# EasyEDA schematic A2D_ascii.SchDoc_2021-05-28.json

## Sheets
1 A2D
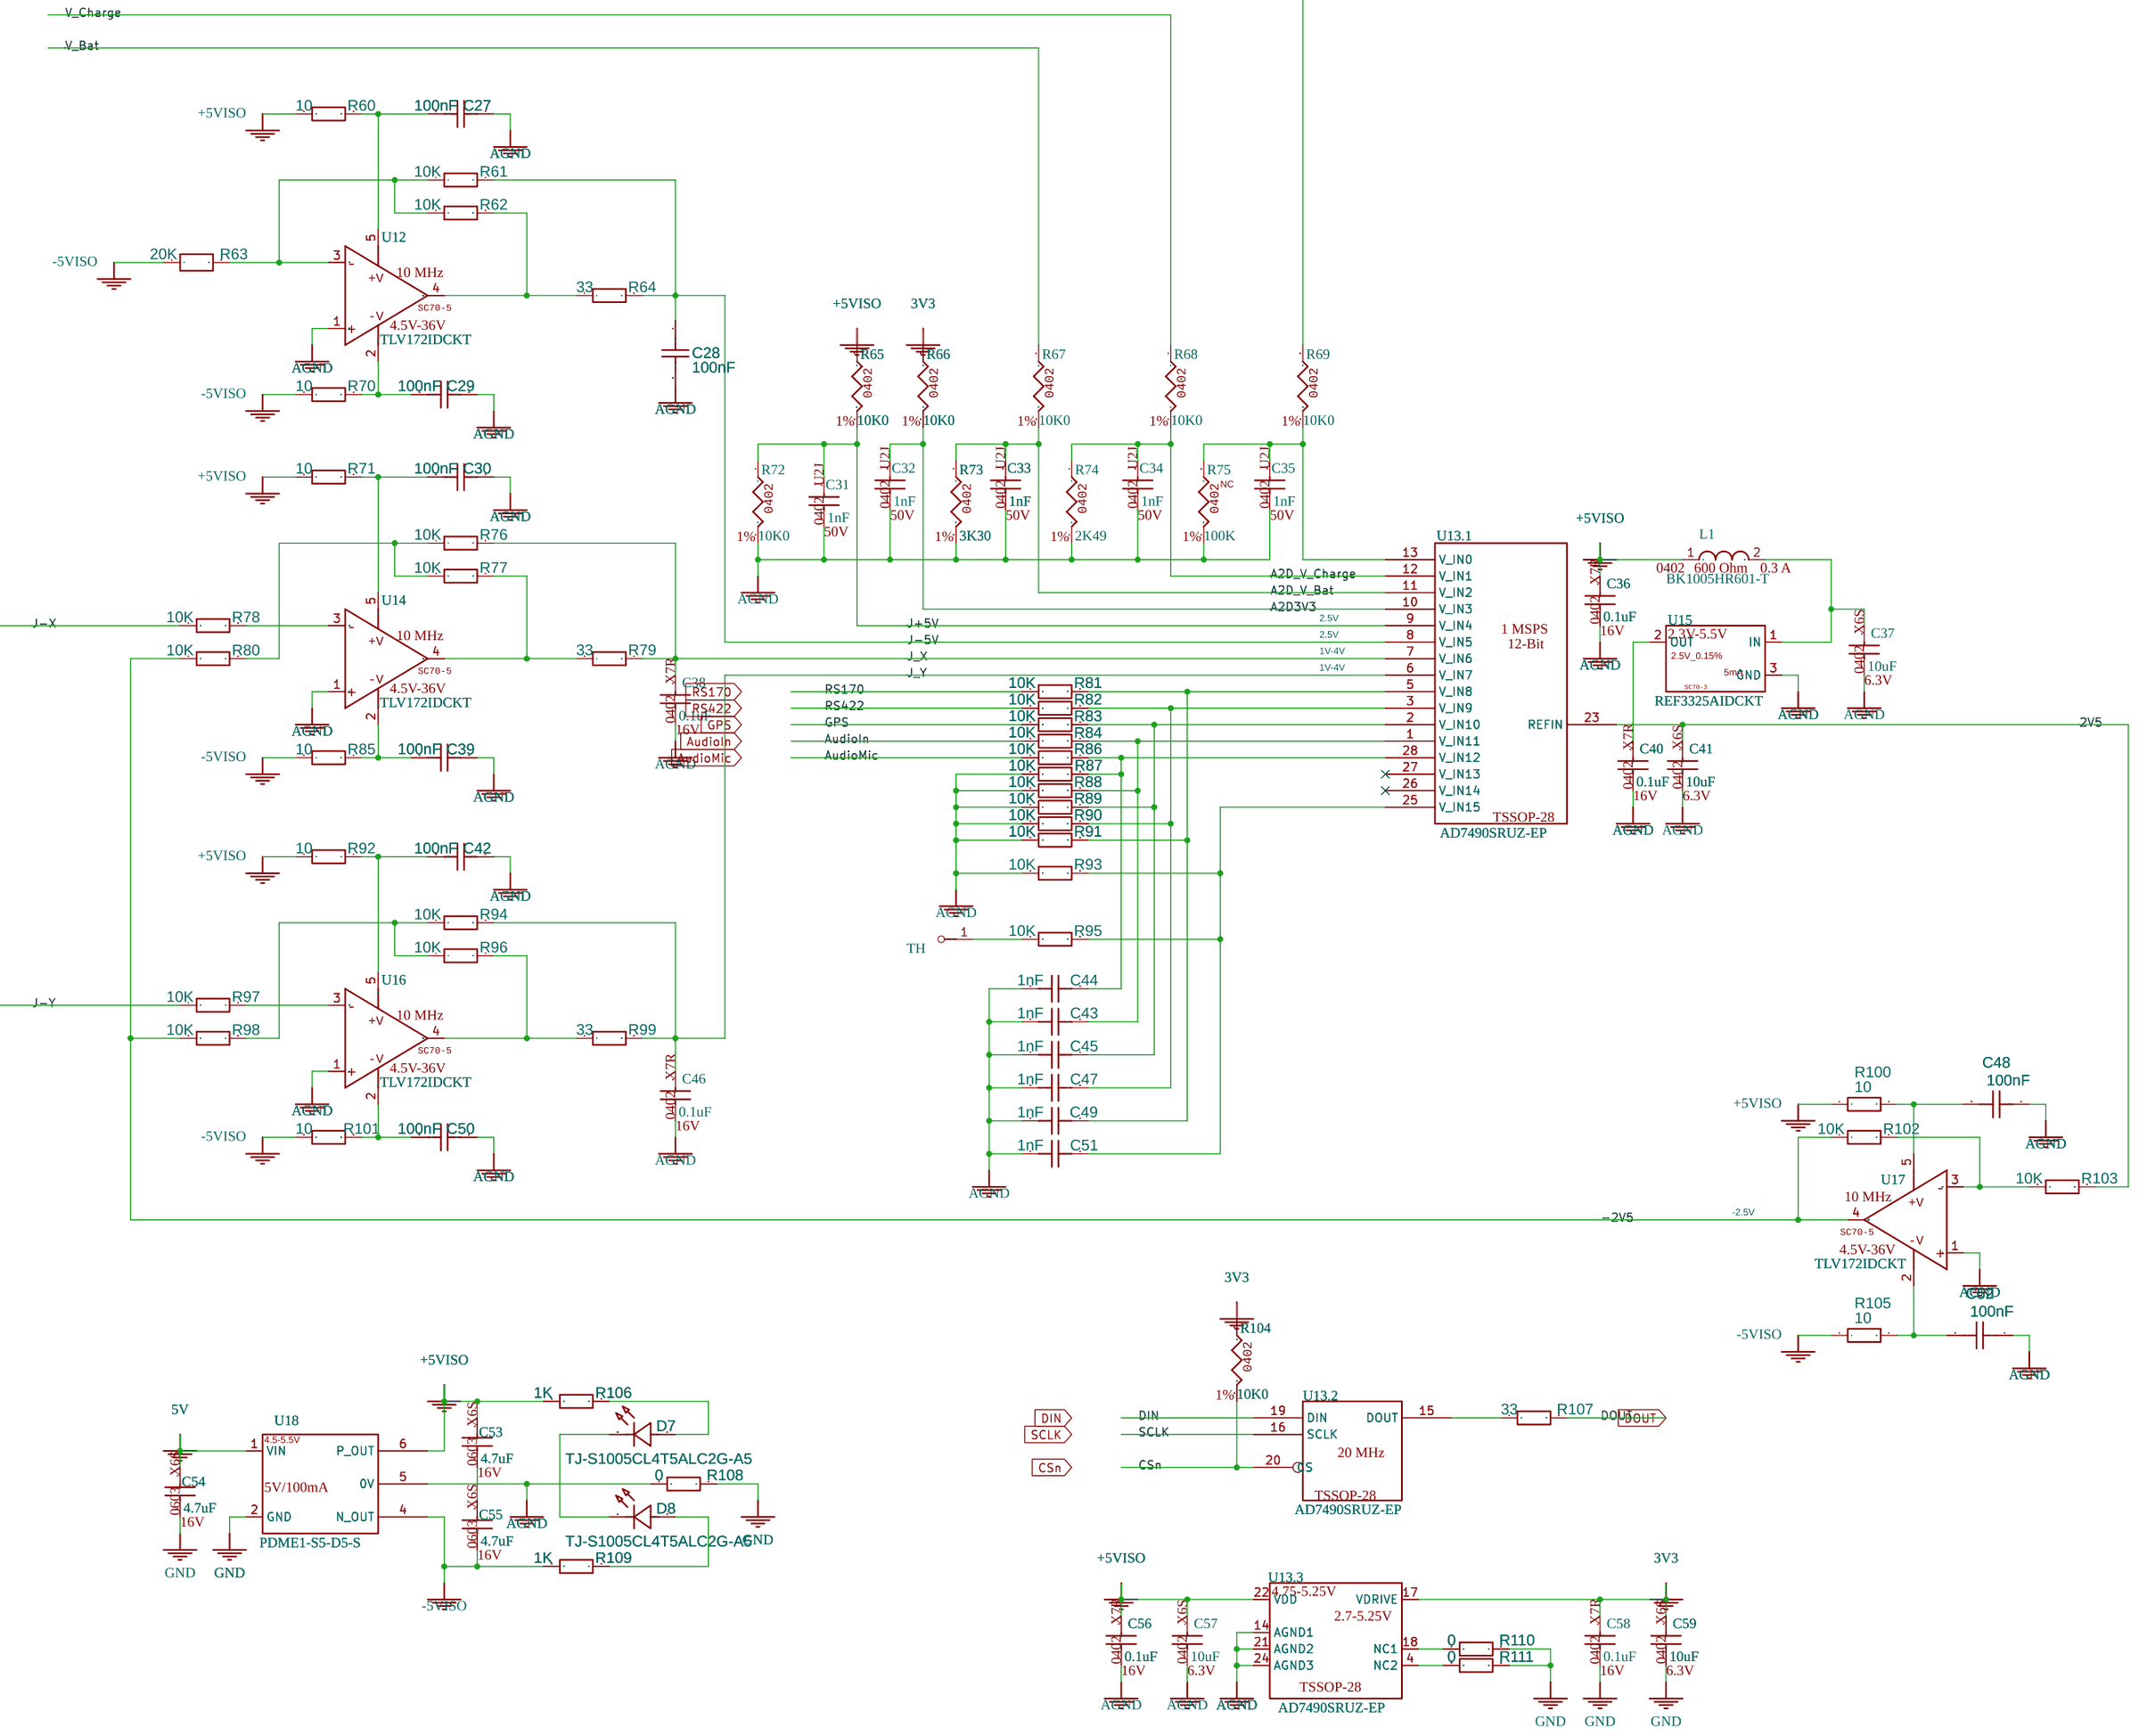
[diagram p0: A2D]
2 Main
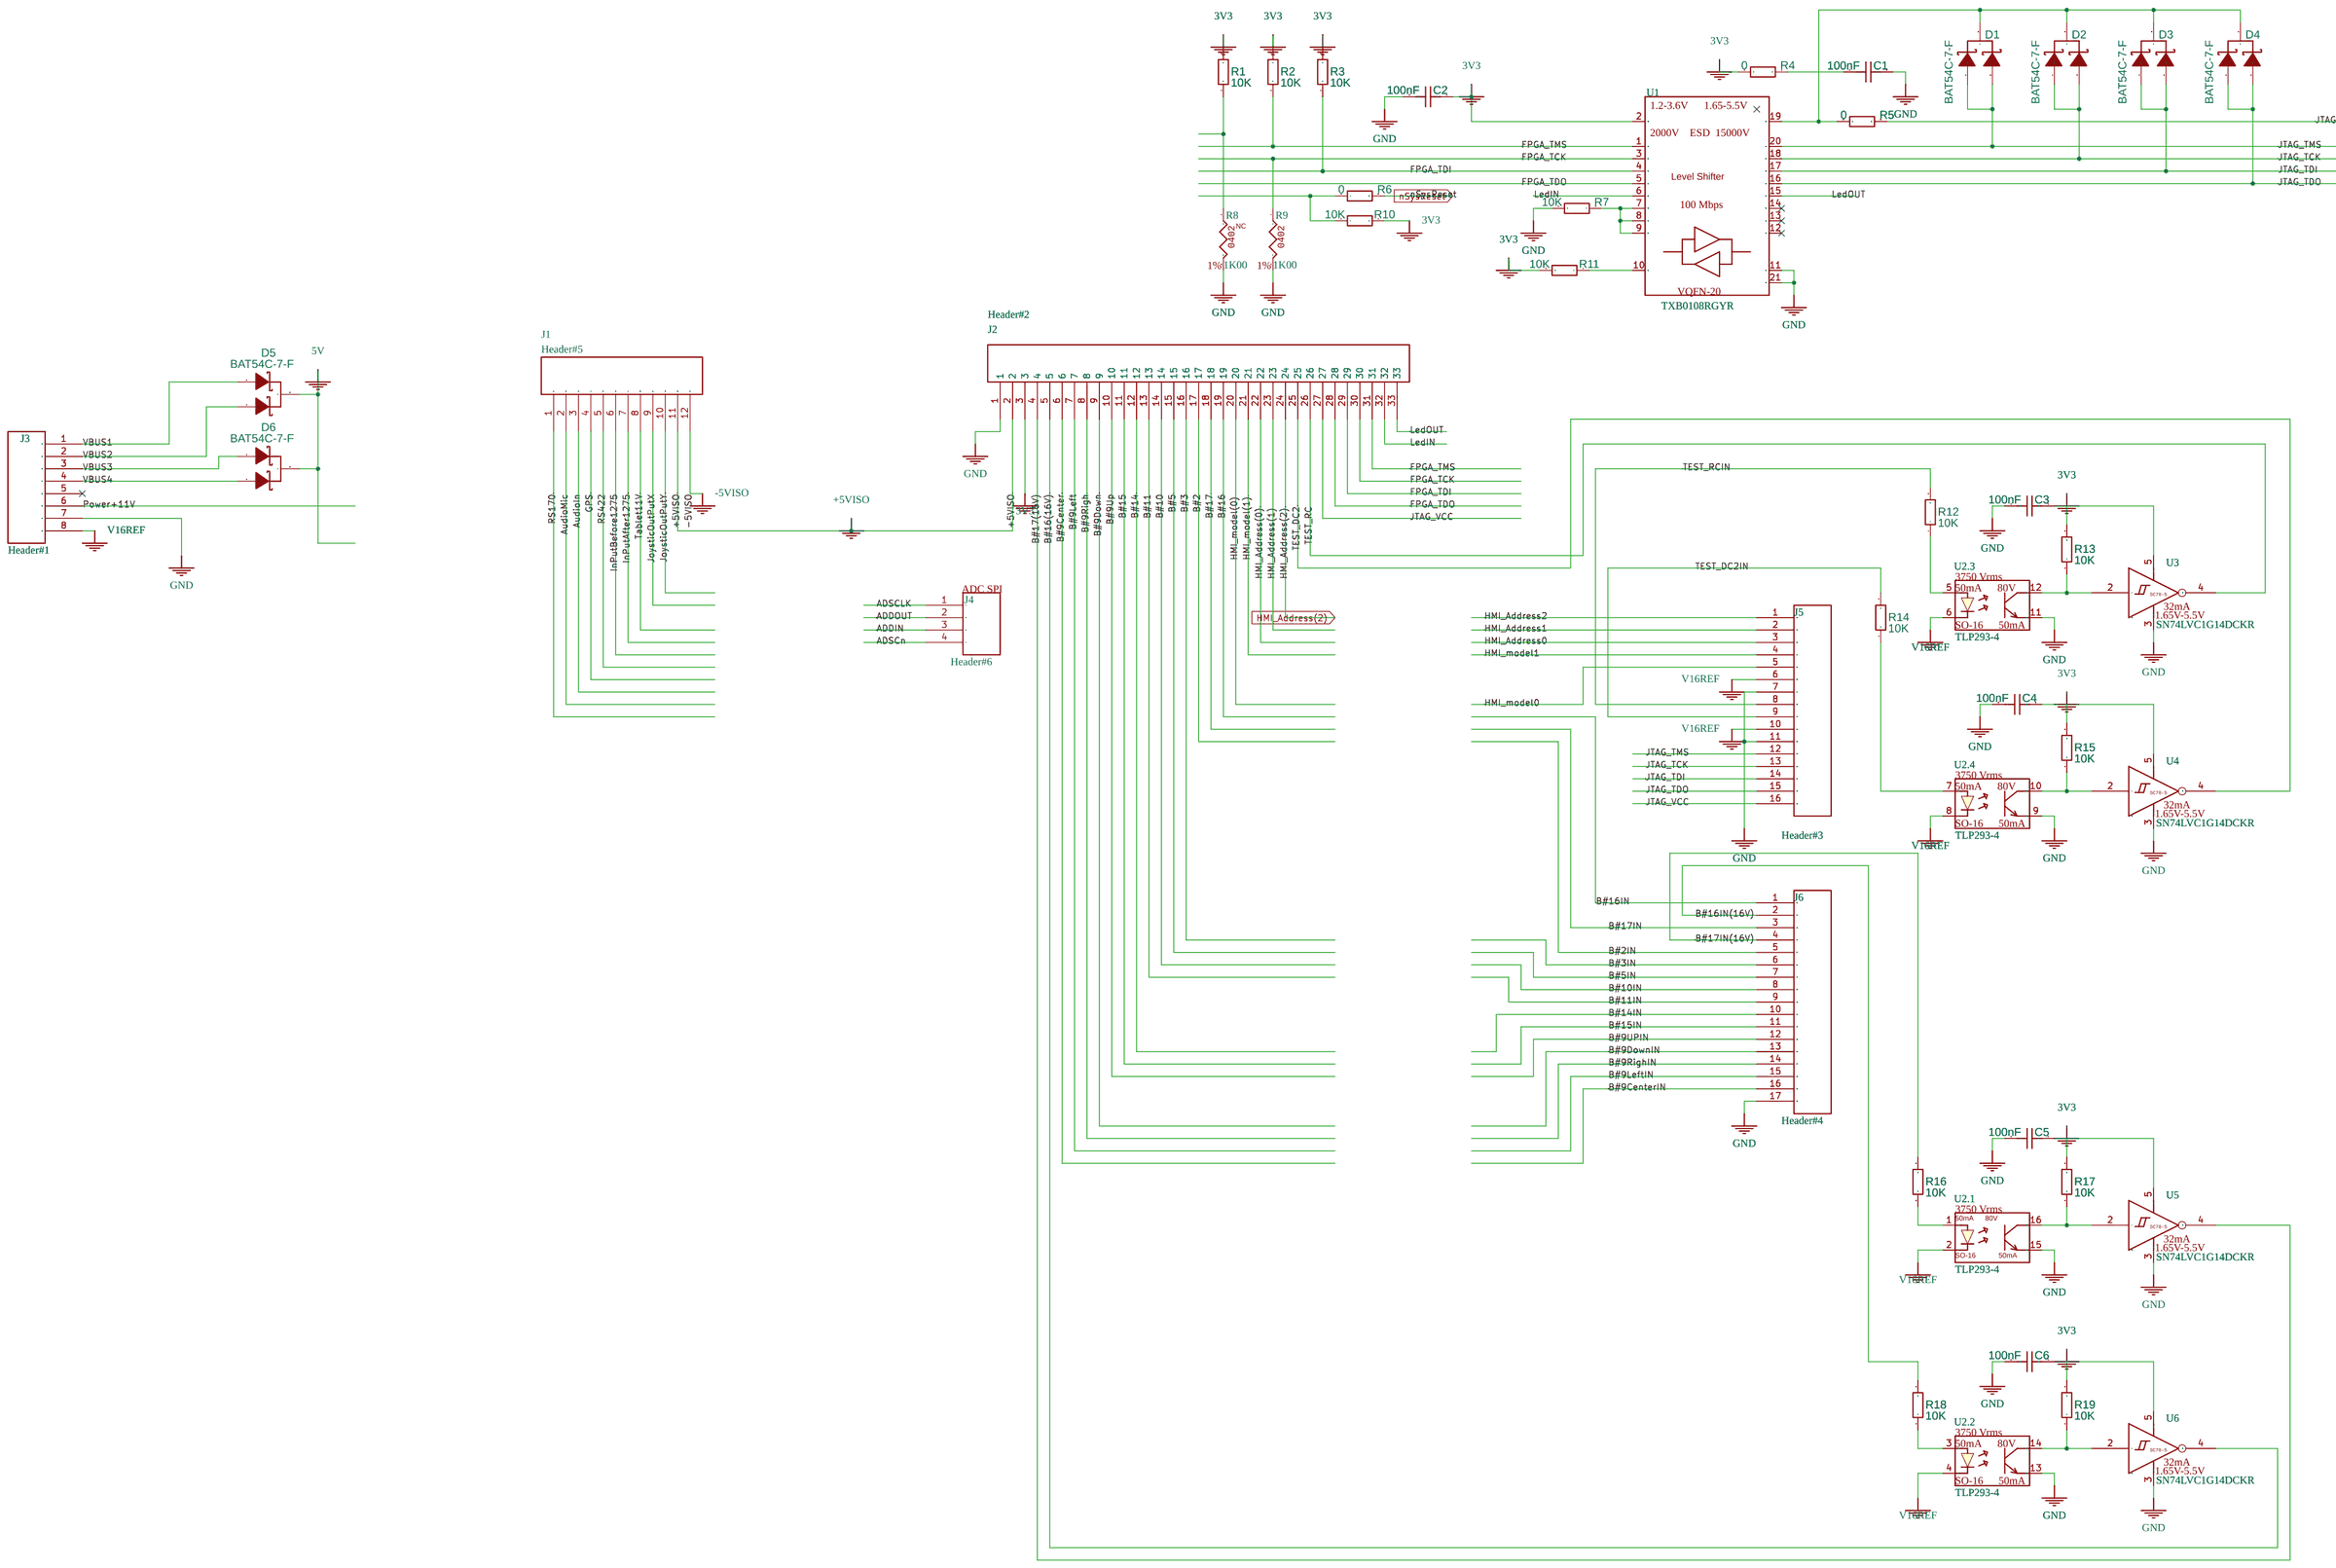
[diagram p1: Main]
3 Power
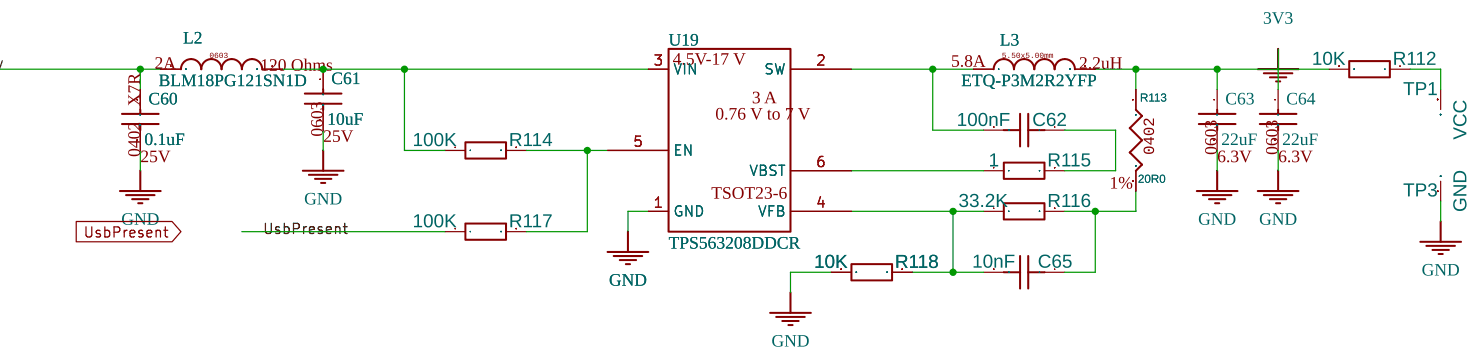
[diagram p2: Power]
4 QuadOPTO
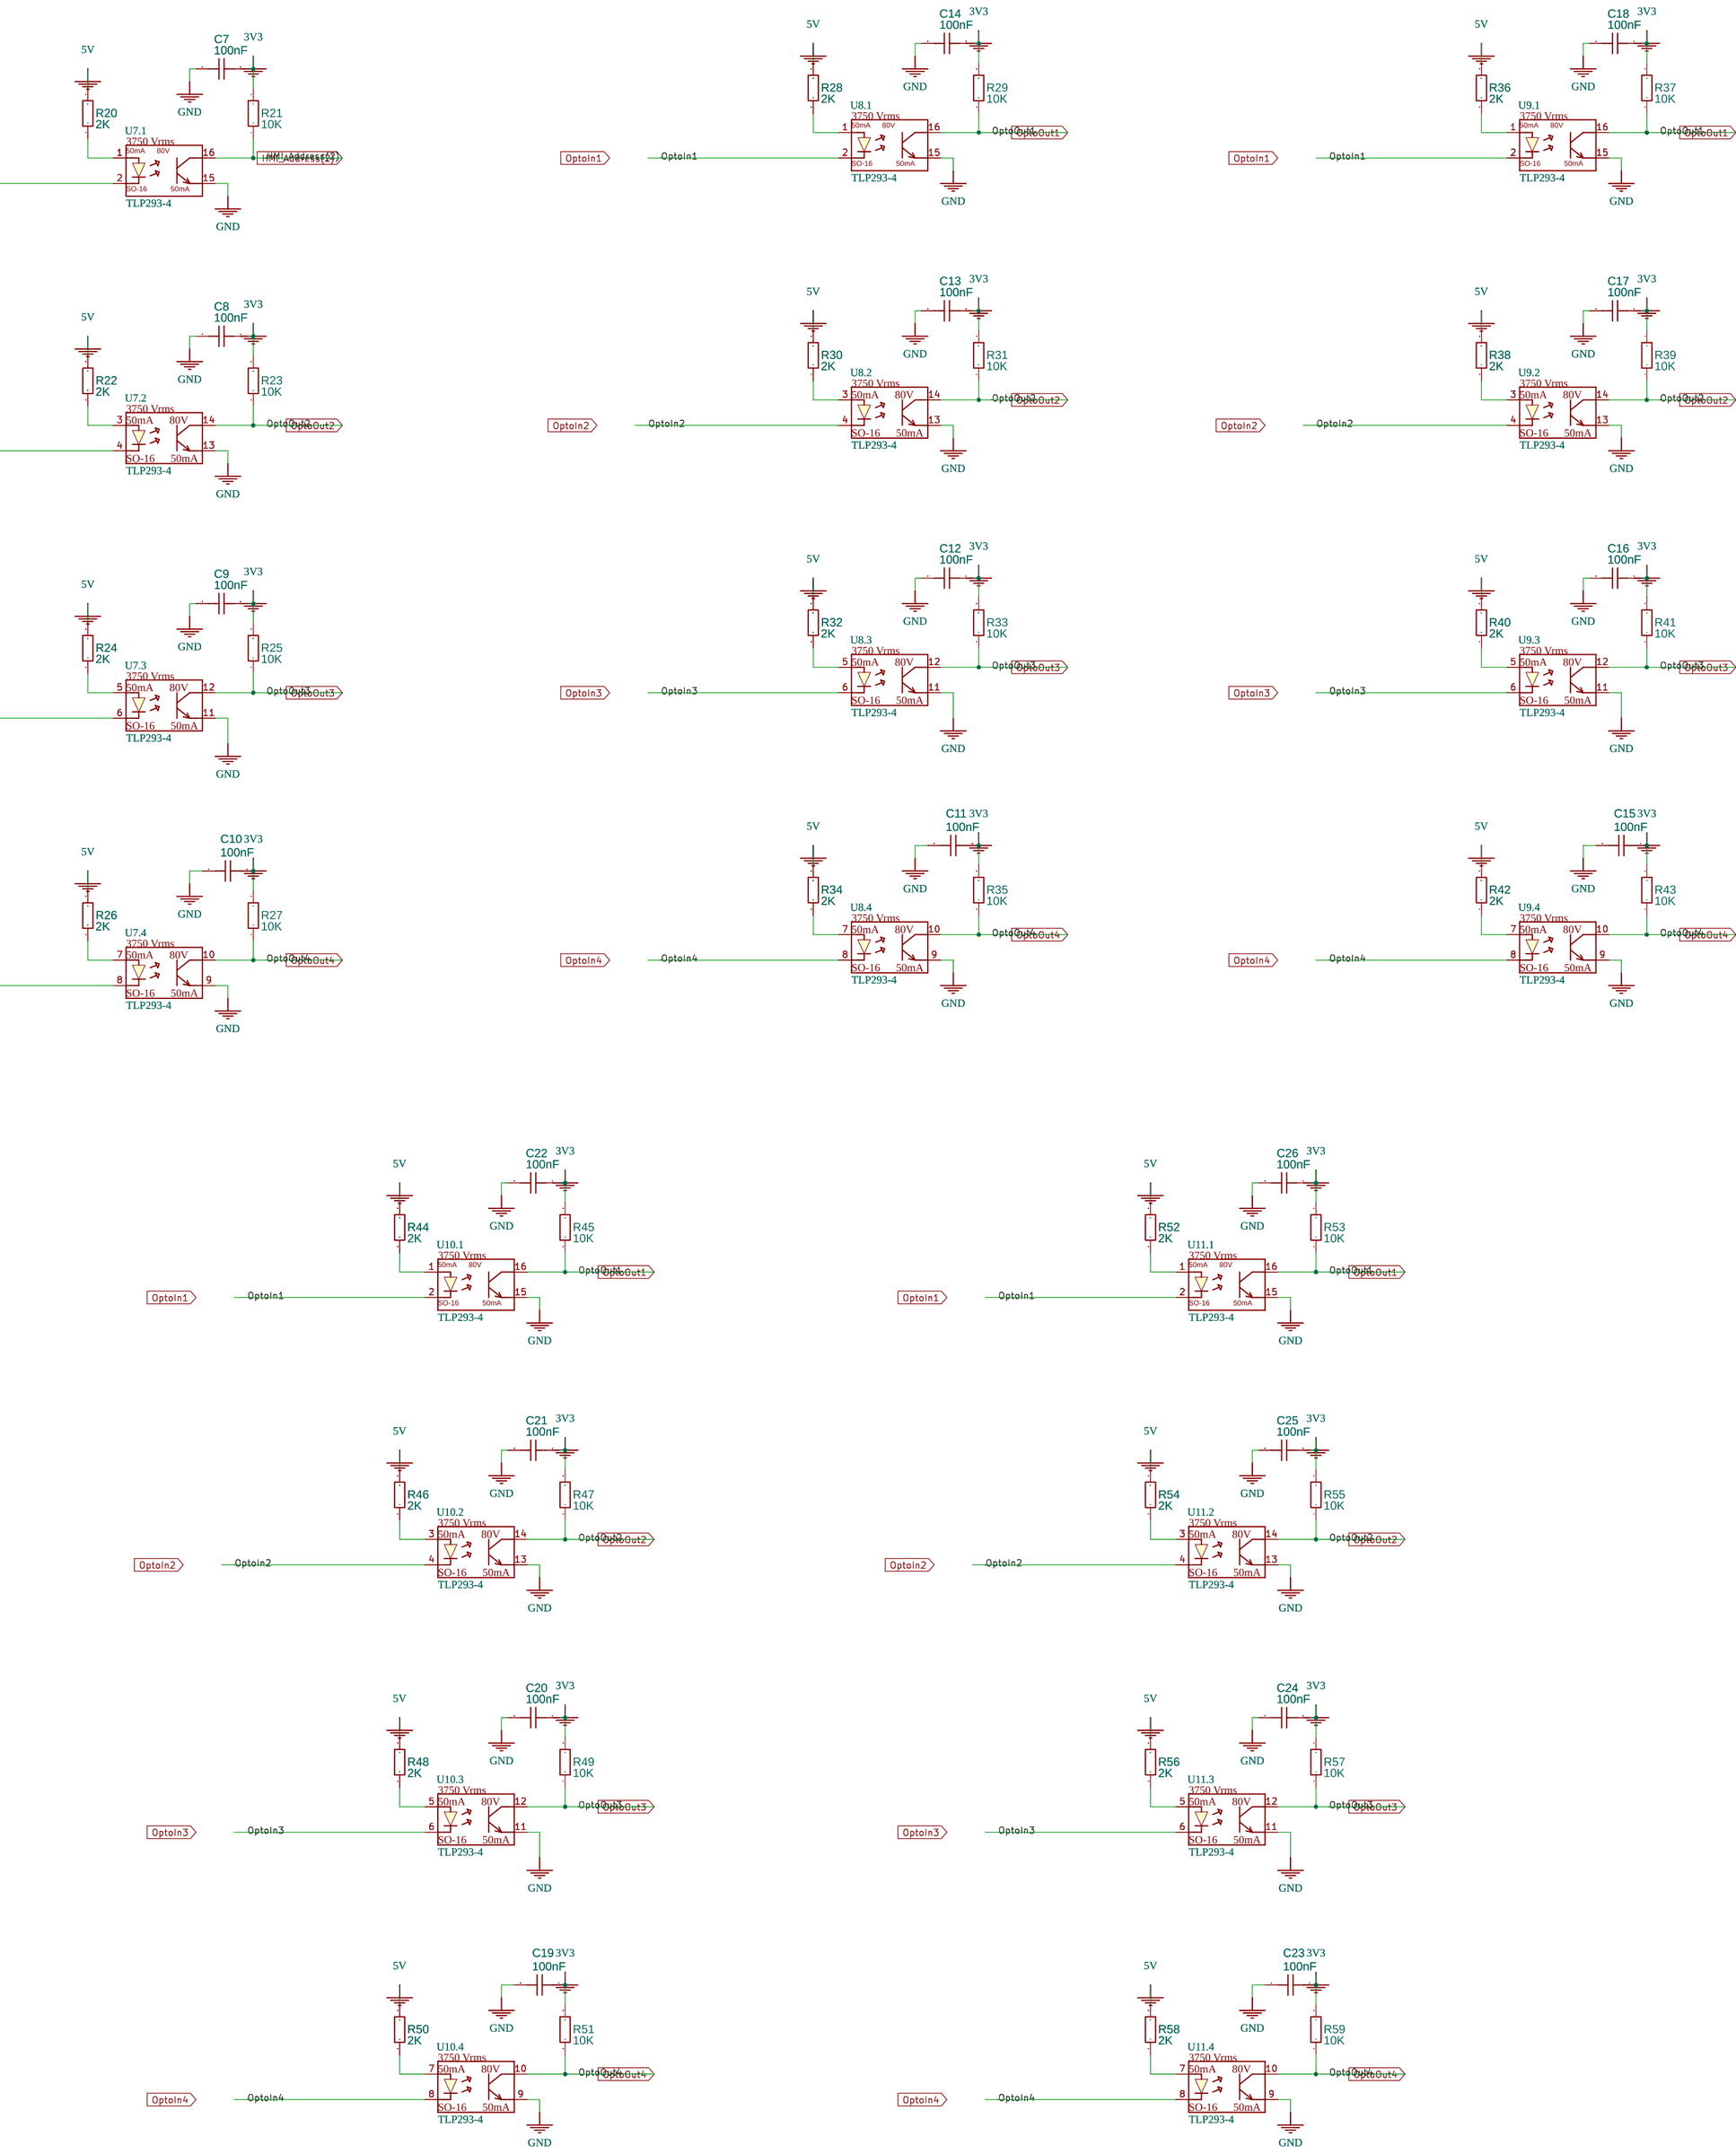
[diagram p3: QuadOPTO]

## Parts
sheet A2D
C27  100nF  [C0402]
C28  100nF  [C0402]
C29  100nF  [C0402]
C30  100nF  [C0402]
C31  1nF  [0402]
C32  1nF  [0402]
C33  1nF  [0402]
C34  1nF  [0402]
C35  1nF  [0402]
C36  0.1uF  [0402]
C37  10uF  [0402]
C38  0.1uF  [0402]
C39  100nF  [C0402]
C40  0.1uF  [0402]
C41  10uF  [0402]
C42  100nF  [C0402]
C43  1nF  [C0402]
C44  1nF  [C0402]
C45  1nF  [C0402]
C46  0.1uF  [0402]
C47  1nF  [C0402]
C48  100nF  [C0402]
C49  1nF  [C0402]
C50  100nF  [C0402]
C51  1nF  [C0402]
C52  100nF  [C0402]
C53  4.7uF  [0603]
C54  4.7uF  [0603]
C55  4.7uF  [0603]
C56  0.1uF  [0402]
C57  10uF  [0402]
C58  0.1uF  [0402]
C59  10uF  [0402]
D7  TJ-S1005CL4T5ALC2G-A5  [LED0402-RD]
D8  TJ-S1005CL4T5ALC2G-A5  [LED0402-RD]
ICT1  TH  [CASCODIUM_TP_ICT]
L1  BK1005HR601-T  [L0402]
R60  10  [R0402]
R61  10K  [R0402]
R62  10K  [R0402]
R63  20K  [R0402]
R64  33  [R0402]
R65  10K0  [0402]
R66  10K0  [0402]
R67  10K0  [0402]
R68  10K0  [0402]
R69  10K0  [0402]
R70  10  [R0402]
R71  10  [R0402]
R72  10K0  [0402]
R73  3K30  [0402]
R74  2K49  [0402]
R75  100K  [0402]
R76  10K  [R0402]
R77  10K  [R0402]
R78  10K  [R0402]
R79  33  [R0402]
R80  10K  [R0402]
R81  10K  [R0402]
R82  10K  [R0402]
R83  10K  [R0402]
R84  10K  [R0402]
R85  10  [R0402]
R86  10K  [R0402]
R87  10K  [R0402]
R88  10K  [R0402]
R89  10K  [R0402]
R90  10K  [R0402]
R91  10K  [R0402]
R92  10  [R0402]
R93  10K  [R0402]
R94  10K  [R0402]
R95  10K  [R0402]
R96  10K  [R0402]
R97  10K  [R0402]
R98  10K  [R0402]
R99  33  [R0402]
R100  10  [R0402]
R101  10  [R0402]
R102  10K  [R0402]
R103  10K  [R0402]
R104  10K0  [0402]
R105  10  [R0402]
R106  1K  [R0402]
R107  33  [R0402]
R108  0  [R0402]
R109  1K  [R0402]
R110  0  [R0402]
R111  0  [R0402]
U12  TLV172IDCKT  [SC70-5]
U13  AD7490SRUZ-EP  [TSSOP-28_AD7490SRUZ]  (sections 1,2,3)
U14  TLV172IDCKT  [SC70-5]
U15  REF3325AIDCKT  [SC70-3_REF3320AIDCKR]
U16  TLV172IDCKT  [SC70-5]
U17  TLV172IDCKT  [SC70-5]
U18  PDME1-S5-D5-S  [PDME1-S5-D5-S]
sheet Main
C1  100nF  [C0402]
C2  100nF  [C0402]
C3  100nF  [C0402]
C4  100nF  [C0402]
C5  100nF  [C0402]
C6  100nF  [C0402]
D1  BAT54C-7-F  [SOT-23-3_L2.9-W1.6-P1.90-LS2.8-BR]
D2  BAT54C-7-F  [SOT-23-3_L2.9-W1.6-P1.90-LS2.8-BR]
D3  BAT54C-7-F  [SOT-23-3_L2.9-W1.6-P1.90-LS2.8-BR]
D4  BAT54C-7-F  [SOT-23-3_L2.9-W1.6-P1.90-LS2.8-BR]
D5  BAT54C-7-F  [SOT-23-3_L2.9-W1.6-P1.90-LS2.8-BR]
D6  BAT54C-7-F  [SOT-23-3_L2.9-W1.6-P1.90-LS2.8-BR]
J1  Header#5  [39-28-1123]
J2  Header#2  [501190-3027]
J3  Header#1  [CONN-TH_7P-P2.50_B07B-XASK-1-A-LF-SN]
J4  Header#6  [B04B-XASK-1]
J5  Header#3  [501568-1507]
J6  Header#4  [501568-1507]
R1  10K  [R0402]
R2  10K  [R0402]
R3  10K  [R0402]
R4  0  [R0402]
R5  0  [R0402]
R6  0  [R0402]
R7  10K  [R0402]
R8  1K00  [0402]
R9  1K00  [0402]
R10  10K  [R0402]
R11  10K  [R0402]
R12  10K  [R0402]
R13  10K  [R0402]
R14  10K  [R0402]
R15  10K  [R0402]
R16  10K  [R0402]
R17  10K  [R0402]
R18  10K  [R0402]
R19  10K  [R0402]
U1  TXB0108RGYR  [VQFN-20_L4.5-W3.5-P0.50-BL-EP]
U2  TLP293-4  [SO-16_L10.3-W4.4-P1.27-LS7.0-BL]  (sections 1,2,3,4)
U3  SN74LVC1G14DCKR  [SC-70-5_L2.1-W1.3-P0.65-LS2.1-BR]
U4  SN74LVC1G14DCKR  [SC-70-5_L2.1-W1.3-P0.65-LS2.1-BR]
U5  SN74LVC1G14DCKR  [SC-70-5_L2.1-W1.3-P0.65-LS2.1-BR]
U6  SN74LVC1G14DCKR  [SC-70-5_L2.1-W1.3-P0.65-LS2.1-BR]
sheet Power
C60  0.1uF  [0402]
C61  10uF  [0603]
C62  100nF  [C0402]
C63  22uF  [0603]
C64  22uF  [0603]
C65  10nF  [C0402]
L2  BLM18PG121SN1D  [L0603]
L3  ETQ-P3M2R2YFP  [ETQ-P3M2R2YFP]
R112  10K  [R0402]
R113  20R0  [0402]
R114  100K  [R0402]
R115  1  [R0402]
R116  33.2K  [R0402]
R117  100K  [R0402]
R118  10K  [R0402]
TP1  VCC  [TESTPOINT_SMT]
TP3  GND  [TESTPOINT_SMT]
U19  TPS563208DDCR  [TSOT-23-6_L2.9-W1.6-P0.95-LS2.8-BL]
sheet QuadOPTO
C7  100nF  [C0402]
C8  100nF  [C0402]
C9  100nF  [C0402]
C10  100nF  [C0402]
C11  100nF  [C0402]
C12  100nF  [C0402]
C13  100nF  [C0402]
C14  100nF  [C0402]
C15  100nF  [C0402]
C16  100nF  [C0402]
C17  100nF  [C0402]
C18  100nF  [C0402]
C19  100nF  [C0402]
C20  100nF  [C0402]
C21  100nF  [C0402]
C22  100nF  [C0402]
C23  100nF  [C0402]
C24  100nF  [C0402]
C25  100nF  [C0402]
C26  100nF  [C0402]
R20  2K  [R0402]
R21  10K  [R0402]
R22  2K  [R0402]
R23  10K  [R0402]
R24  2K  [R0402]
R25  10K  [R0402]
R26  2K  [R0402]
R27  10K  [R0402]
R28  2K  [R0402]
R29  10K  [R0402]
R30  2K  [R0402]
R31  10K  [R0402]
R32  2K  [R0402]
R33  10K  [R0402]
R34  2K  [R0402]
R35  10K  [R0402]
R36  2K  [R0402]
R37  10K  [R0402]
R38  2K  [R0402]
R39  10K  [R0402]
R40  2K  [R0402]
R41  10K  [R0402]
R42  2K  [R0402]
R43  10K  [R0402]
R44  2K  [R0402]
R45  10K  [R0402]
R46  2K  [R0402]
R47  10K  [R0402]
R48  2K  [R0402]
R49  10K  [R0402]
R50  2K  [R0402]
R51  10K  [R0402]
R52  2K  [R0402]
R53  10K  [R0402]
R54  2K  [R0402]
R55  10K  [R0402]
R56  2K  [R0402]
R57  10K  [R0402]
R58  2K  [R0402]
R59  10K  [R0402]
U7  TLP293-4  [SO-16_L10.3-W4.4-P1.27-LS7.0-BL]  (sections 1,2,3,4)
U8  TLP293-4  [SO-16_L10.3-W4.4-P1.27-LS7.0-BL]  (sections 1,2,3,4)
U9  TLP293-4  [SO-16_L10.3-W4.4-P1.27-LS7.0-BL]  (sections 1,2,3,4)
U10  TLP293-4  [SO-16_L10.3-W4.4-P1.27-LS7.0-BL]  (sections 1,2,3,4)
U11  TLP293-4  [SO-16_L10.3-W4.4-P1.27-LS7.0-BL]  (sections 1,2,3,4)

## Library data of the parts
C1-C30 C39 C42 C48 C50 C52 C62 = C1005X7R1C104KT000F: Supplier: LCSC; Supplier Part: C338032; Manufacturer: TDK; Contributor: LCSC
C31-C35 = -: VOLTAGE: 50V; TYPE: U2J; Part Number: C0402C102J5JAC7867; PCBFootPrint: 0402   U2J; OVPN: OVCC00016; NO_XNET_CONNECTION: True; MFG: KEMET; ALT_SYMBOLS: 0402_RND
C36 C38 C40 C46 C56 C58 = -: NO_XNET_CONNECTION: True; VOLTAGE: 16V; TYPE: X7R; Part Number: CC0402KRX7R7BB104; PCBFootPrint: 0402   X7R; OVPN: OVCC00002; MFG: Yageo; ALT_SYMBOLS_HARD: 0402_RND; ALT_SYMBOLS: 0402_RND
C37 C41 C57 C59 = -: VOLTAGE: 6.3V; TYPE: X6S; Part Number: GRM155C80J106ME11J; PCBFootPrint: 0402   X6S; OVPN: OVCC00087; NO_XNET_CONNECTION: True; MFG: Murata Electronics
C43-C45 C47 C49 C51 = 0402B102K500CT: Supplier: LCSC; Supplier Part: C301925; Manufacturer: Huaxin S&T; Contributor: LCSC
C53-C55 = -: VOLTAGE: 16V; Part Number: C1608X6S1C475M080AC; PCBFootPrint: 0603   X6S; OVPN: OVCC00034; NO_XNET_CONNECTION: True; MFG: TDK Corporation
D7 D8 = TJ-S1005CL4T5ALC2G-A5: Supplier: LCSC; Supplier Part: C917188; Manufacturer: TOGIALED; Contributor: LCSC; JLCPCB Part Class: Extended Part
ICT1 = -: ASSY: N/A; PCB Footprint: ICT
L1 = -: Impedance: 600 Ohm; PcbFootPrint: 0402; OVPN: OVLF00014; NO_XNET_CONNECTION: True; MFG: Taiyo Yuden; Current: 0.3 A
R60 R70 R71 R85 R92 R100 R101 R105 = RTT0210R0FTH: Supplier: LCSC; Manufacturer: RALEC; Supplier Part: C102766; JLCPCB Part Class: Extended Part
R1-R3 R7 R10-R19 R21 R23 R25 R27 R29 R31 R33 R35 R37 R39 R41 R43 R45 R47 R49 R51 R53 R55 R57 R59 R61 R62 R76-R78 R80-R84 R86-R91 R93-R98 R102 R103 R112 R118 = 0402WGF1002TCE: Supplier: LCSC; Manufacturer: UniOhm; Supplier Part: C25744; JLCPCB Part Class: Basic Part
R63 = CR-02FL6---20K: Supplier: LCSC; Supplier Part: C409679; Manufacturer: Viking Tech; Contributor: LCSC
R64 R79 R99 R107 = RC0402FR-0733RL: Supplier: LCSC; Manufacturer: YAGEO; Contributor: LCSC; Supplier Part: C138002
R65-R69 R72 R104 = -: NO_XNET_CONNECTION: True; Tolerance: 1%; Power: 1/16W; Part Number: RC0402FR-0710KL; OVPN: OVRS00009; MOUNTING: SMT; MFG: Yageo
R73 = -: Tolerance: 1%; Power: 1/16W; Part Number: RT0402FRE073K3L; OVPN: OVRS00028; NO_XNET_CONNECTION: True; MOUNTING: SMT; MFG: Yageo
R74 = -: NO_XNET_CONNECTION: True; Tolerance: 1%; Power: 1/16W; Part Number: RC0402FR-072K49L; OVPN: OVRS00004; MOUNTING: SMT; MFG: Yageo
R75 = -: NO_XNET_CONNECTION: True; Tolerance: 1%; Power: 1/16W; Part Number: RC0402FR-07100KL; OVPN: OVRS00003; MOUNTING: SMT; MFG: Yageo; ASSY: NC
R106 R109 = RC0402FR-071KL: Supplier: LCSC; Manufacturer: YAGEO; Supplier Part: C106235; Paste Type: Extended Part; JLCPCB Part Class: Extended Part
R4-R6 R108 R110 R111 = RC0402JR-070RL: Supplier: LCSC; Manufacturer: YAGEO; Supplier Part: C60485; JLCPCB Part Class: Extended Part
U12 = -: Bandwidth: 10 MHz; MFG: Texas Instruments; OVPN: OVIC00220; VOLTAGE: 4.5V-36V; PCB Footprint: SC70-5_TLV172IDCKT; Package Display: No
U13 = -: fSCLK: 20 MHz; Voltage: 2.7-5.25V; VDD: 4.75-5.25V; Throughput rates: 1 MSPS; Resolution: 12-Bit; PcbFootprint: TSSOP-28; PART NUMBER: AD7490SRUZ-EP-RL7; OVPN: OVIC00219; MFG: Analog Devices Inc.
U14 U16 U17 = -: Bandwidth: 10 MHz; MFG: Texas Instruments; OVPN: OVIC00220; VOLTAGE: 4.5V-36V; PCB Footprint: SC70-5_TLV172IDCKT
U15 = -: Current: 5mA; Definition: 2.5V_0.15%; MFG: Texas Instruments; OVPN: OVIC00251; Voltage: 2.3V-5.5V
U18 = -: Power: 4.5-5.5V; MFG: CUI Inc.; Voltage: 5V/100mA; OVPN: OVIC00225
D1-D6 = BAT54C-7-F: Supplier: LCSC; Manufacturer: DIODES; Contributor: LCSC; Supplier Part: C134405; JLCPCB Part Class: Extended Part
J1 = -: Lumenis Part Number: CN-2005424; Power: 600V; Pitch: 4.2mm
J2 = -: Power: 50V; Lumenis Part Number: CN-2006128; Foot Print: 1.00mm; Current: 1 A
J3 = -: P/N: PO11108410
J4 = -: P/N: PO11108404; Label: ADC SPI
J5 J6 = -: Lumenis Part Number: CN-2002538
R8 = -: NO_XNET_CONNECTION: True; Tolerance: 1%; Power: 1/16W; Part Number: RC0402FR-071KL; OVPN: OVRS00022; MOUNTING: SMT; MFG: Yageo; ASSY: NC
R9 = -: NO_XNET_CONNECTION: True; Tolerance: 1%; Power: 1/16W; Part Number: RC0402FR-071KL; OVPN: OVRS00022; MOUNTING: SMT; MFG: Yageo
U1 = -: Data rate: 100 Mbps; Voltage: 1.2-3.6V      1.65-5.5V; PcbFootprint: VQFN-20; OVPN: OVIC00147; MFG: Texas Instruments; ESD: 2000V    ESD  15000V; PCB Footprint: VQFN-20_TXB0108
U2 U7-U11 = -: Power: 50mA      80V; PART NUMBER: TLP293-4(V4,E; OVPN: OVIC00228; MFG: Toshiba Semiconductor and Storage; ISO: 3750 Vrms; Current Power: 50mA; PCB Footprint: SO-16_TLP293-4
U3-U6 = -: VOLTAGE: 1.65V-5.5V; OVPN: OVIC00204; MFG: Texas Instruments; Current: 32mA; PCB Footprint: SC70-5_SN74LVC1G14DCKR
C60 = -: ALT_SYMBOLS: 0402_RND; MFG: Murata Electronics; NO_XNET_CONNECTION: True; OVPN: OVCC00093; Part Number: GRM155R71E104KE14D; TYPE: X7R; VOLTAGE: 25V
C61 = -: VOLTAGE: 25V; TYPE: X5R; Part Number: CL10A106MA8NRNC; OVPN: OVCC00088; MFG: Samsung Electro-Mechanics
C63 C64 = -: MFG: Murata Electronics; OVPN: OVCC00080; Part Number: GRM188C80J226ME15D; TYPE: X6S; VOLTAGE: 6.3V
C65 = CC0402JRX7R9BB103: Supplier: LCSC; Supplier Part: C272878; Manufacturer: YAGEO; Contributor: LCSC; JLCPCB Part Class: Extended Part
L2 = -: NO_XNET_CONNECTION: True; OVPN: OVLF00001; MFG: Murata Electronics; Impedance: 120 Ohms; Current: 2A
L3 = -: Inductance: 2.2uH; Current: 5.8A; MFG: Panasonic Electronic Components; OVPN: OVLP00029
R113 = -: Tolerance: 1%; Power: 1/16W; Part Number: RC0402FR-0720RL; OVPN: OVRS00055; NO_XNET_CONNECTION: True; MOUNTING: SMT; MFG: Yageo
R114 R117 = RC0402FR-07100KL: Supplier: LCSC; Manufacturer: YAGEO; Supplier Part: C60491; JLCPCB Part Class: Extended Part
R115 = 0402WGF100KTCE: Supplier: LCSC; Manufacturer: UniOhm; Supplier Part: C25086; JLCPCB Part Class: Basic Part
R116 = AC0402FR-0733K2L: Supplier: LCSC; Supplier Part: C226998; Manufacturer: YAGEO; Contributor: LCSC; JLCPCB Part Class: Extended Part
TP1 TP3 = TESTPOINT: Contributor: edwardvh
U19 = -: Current: 3 A; MFG: Texas Instruments; OUT_VOLTAGE: 0.76 V to 7 V; OVPN: OVIC00130; PcbFootprint: TSOT23-6; VOLTAGE: 4.5V-17 V; PCB Footprint: TSOT23-6_TPS563208DDCR
R20 R22 R24 R26 R28 R30 R32 R34 R36 R38 R40 R42 R44 R46 R48 R50 R52 R54 R56 R58 = RN731ETTP2001F25: Supplier: LCSC; Manufacturer: KOA; Contributor: LCSC; Supplier Part: C134242; JLCPCB Part Class: Extended Part

## Nets
2V5: C40.1 C41.1 R103.2 U13.23(REFIN) U15.2(OUT)
3V3: C2.1 C7.1 C8.1 C9.1 C10.1 C11.1 C12.1 C13.1 C14.1 C15.1 C16.1 C17.1 C18.1 C19.1 C20.1 C21.1 C22.1 C23.1 C24.1 C25.1 C26.1 C58.1 C59.1 C64.1 J2.3 R1.2 R2.1 R3.2 R4.1 R10.2 R11.2 R13.2 R15.2 R17.2 R19.2 R21.2 R23.2 R25.2 R27.2 R29.2 R31.2 R33.2 R35.2 R37.2 R39.2 R41.2 R43.2 R45.2 R47.2 R49.2 R51.2 R53.2 R55.2 R57.2 R59.2 R66.1 R104.1 U1.2(VCCA) U13.17(VDRIVE)
5V: C54.1 D5.3(K) D6.3(K) R20.2 R22.2 R24.2 R26.2 R28.2 R30.2 R32.2 R34.2 R36.2 R38.2 R40.2 R42.2 R44.2 R46.2 R48.2 R50.2 R52.2 R54.2 R56.2 R58.2 U18.1(VIN)
+5VISO: C36.1 C53.1 C56.1 C57.1 J1.11 J2.2 L1.1 R60.1 R65.1 R71.1 R92.1 R100.1 R106.1 U13.22(VDD) U18.6(P_OUT)
-2V5: R80.1 R98.1 R102.1 U17.4(OutPut)
-5VISO: C55.2 J1.12 R63.1 R70.1 R85.1 R101.1 R105.1 R109.1 U18.4(N_OUT)
AGND: C27.1 C28.2 C29.1 C30.1 C31.2 C32.2 C33.2 C34.2 C35.2 C36.2 C37.2 C38.2 C39.1 C40.2 C41.2 C42.1 C43.1 C44.1 C45.1 C46.2 C47.1 C48.1 C49.1 C50.1 C51.1 C52.1 C56.2 C57.2 R72.2 R73.2 R74.2 R75.2 R87.1 R88.1 R89.1 R90.1 R91.1 R93.1 R108.1 U12.1(+In) U13.14(AGND1) U13.21(AGND2) U13.24(AGND3) U14.1(+In) U15.3(GND) U16.1(+In) U17.1(+In) U18.5(0V)
GND: C1.1 C2.2 C3.2 C4.2 C5.2 C6.2 C7.2 C8.2 C9.2 C10.2 C11.2 C12.2 C13.2 C14.2 C15.2 C16.2 C17.2 C18.2 C19.2 C20.2 C21.2 C22.2 C23.2 C24.2 C25.2 C26.2 C54.2 C58.2 C59.2 C60.2 C61.2 C63.2 C64.2 J2.1 J3.7 J5.7 J5.11 J6.17 R7.2 R8.2 R9.2 R108.2 R110.2 R111.2 R118.2 TP3.P$1 U1.11(GND) U1.21(EP) U2.9(E) U2.11(E) U2.13(E) U2.15(E) U3.3(GND) U4.3(GND) U5.3(GND) U6.3(GND) U7.9(E) U7.11(E) U7.13(E) U7.15(E) U8.9(E) U8.11(E) U8.13(E) U8.15(E) U9.9(E) U9.11(E) U9.13(E) U9.15(E) U10.9(E) U10.11(E) U10.13(E) U10.15(E) U11.9(E) U11.11(E) U11.13(E) U11.15(E) U18.2(GND) U19.1(GND)
V16REF: J3.8 J5.6 J5.10 U2.2(K) U2.4(K) U2.6(K) U2.8(K)
VBUS1: D5.1(A) J3.1
VBUS2: D5.2(A) J3.2
VBUS3: D6.1(A) J3.3
VBUS4: D6.2(A) J3.4
A2D3V3: C32.1 R66.2 U13.10(V IN3)
A2D_V_Bat: C33.1 R67.2 R73.1 U13.11(V IN2)
A2D_V_Charge: C34.1 R68.2 R74.1 U13.12(V IN1)
ADDIN: J4.3
ADDOUT: J4.2
ADSCLK: J4.1
ADSCn: J4.4
AudioIn: J1.3 R84.1
AudioMic: J1.2 R86.1
B#2: J2.17
B#2IN: J6.5
B#3: J2.16
B#3IN: J6.6
B#5: J2.15
B#5IN: J6.7
B#9Center: J2.6
B#9CenterIN: J6.16
B#9Down: J2.9
B#9DownIN: J6.13
B#9Left: J2.7
B#9LeftIN: J6.15
B#9Righ: J2.8
B#9RighIN: J6.14
B#9Up: J2.10
B#9UPIN: J6.12
B#10: J2.14
B#10IN: J6.8
B#11: J2.13
B#11IN: J6.9
B#14: J2.12
B#14IN: J6.10
B#15: J2.11
B#15IN: J6.11
B#16: J2.19
B#16(16V): J2.5 U6.4(O)
B#16IN: J6.1
B#16IN(16V): J6.2 R18.2
B#17: J2.18
B#17(16V): J2.4 U5.4(O)
B#17IN: J6.3
B#17IN(16V): J6.4 R16.2
CSn: R104.2 U13.20(CS)
DIN: U13.19(DIN)
DOUT: R107.2
FPGA_TCK: J2.30 R9.1 U1.3(A2)
FPGA_TDI: J2.29 R3.1 U1.4(A3)
FPGA_TDO: J2.28 U1.5(A4)
FPGA_TMS: J2.31 R2.2 U1.1(A1)
GPS: J1.4 R83.1
HMI_Address0: J5.3
HMI_Address1: J5.2
HMI_Address2: J5.1
HMI_Address(0): J2.22
HMI_Address(1): J2.23
HMI_Address(2): J2.24 R21.1 U7.16(C)
HMI_model0: J5.5
HMI_model1: J5.4
HMI_model(0): J2.20
HMI_model(1): J2.21
InPutAfter1275: J1.7
InPutBefore1275: J1.6 R69.1
J+5V: C31.1 R65.2 R72.1 U13.9(V IN4)
J-5V: C28.1 R61.2 R64.2 U13.8(V IN5)
J-X: R78.1
J-Y: R97.1
J_X: C38.1 R76.2 R79.2 U13.7(V IN6)
J_Y: C46.1 R94.2 R99.2 U13.6(V IN7)
JoysticOutPutX: J1.9
JoysticOutPutY: J1.10
JTAG_TCK: D2.1(A) D2.2(A) J5.13 U1.18(B2)
JTAG_TDI: D3.1(A) D3.2(A) J5.14 U1.17(B3)
JTAG_TDO: D4.1(A) D4.2(A) J5.15 U1.16(B4)
JTAG_TMS: D1.1(A) D1.2(A) J5.12 U1.20(B1)
JTAG_VCC: J2.27 J5.16 R5.2
LedIN: J2.32 U1.6(A5)
LedOUT: J2.33 U1.15(B5)
nSysReset: R6.2
OptoIn1: U7.2(K) U8.2(K) U9.2(K) U10.2(K) U11.2(K)
OptoIn2: U7.4(K) U8.4(K) U9.4(K) U10.4(K) U11.4(K)
OptoIn3: U7.6(K) U8.6(K) U9.6(K) U10.6(K) U11.6(K)
OptoIn4: U7.8(K) U8.8(K) U9.8(K) U10.8(K) U11.8(K)
OptoOut1: R29.1 R37.1 R45.1 R53.1 U8.16(C) U9.16(C) U10.16(C) U11.16(C)
OptoOut2: R23.1 R31.1 R39.1 R47.1 R55.1 U7.14(C) U8.14(C) U9.14(C) U10.14(C) U11.14(C)
OptoOut3: R25.1 R33.1 R41.1 R49.1 R57.1 U7.12(C) U8.12(C) U9.12(C) U10.12(C) U11.12(C)
OptoOut4: R27.1 R35.1 R43.1 R51.1 R59.1 U7.10(C) U8.10(C) U9.10(C) U10.10(C) U11.10(C)
Power+11V: C60.1 J3.6 L2.1
RS170: J1.1 R81.1
RS422: J1.5 R82.1
SCLK: U13.16(SCLK)
Tablet11V: J1.8
TEST_DC2: J2.25 U4.4(O)
TEST_DC2IN: J5.9 R14.2
TEST_RC: J2.26 U3.4(O)
TEST_RCIN: J5.8 R12.2
UsbPresent: R117.1
V_Bat: R67.1
V_Charge: R68.1
Net-(C1-2): C1.2 R4.2
Net-(C3-1): C3.1 U3.5(VCC)
Net-(C4-1): C4.1 U4.5(VCC)
Net-(C5-1): C5.1 U5.5(VCC)
Net-(C6-1): C6.1 U6.5(VCC)
Net-(C27-2): C27.2 R60.2 U12.5(+V)
Net-(C29-2): C29.2 R70.2 U12.2(-V)
Net-(C30-2): C30.2 R71.2 U14.5(+V)
Net-(C35-1): C35.1 R69.2 R75.1 U13.13(V IN0)
Net-(C37-1): C37.1 L1.2 U15.1(IN)
Net-(C39-2): C39.2 R85.2 U14.2(-V)
Net-(C42-2): C42.2 R92.2 U16.5(+V)
Net-(C43-2): C43.2 R84.2 R88.2 U13.1(V IN11)
Net-(C44-2): C44.2 R86.2 R87.2 U13.28(V IN12)
Net-(C45-2): C45.2 R83.2 R89.2 U13.2(V IN10)
Net-(C47-2): C47.2 R82.2 R90.2 U13.3(V IN9)
Net-(C48-2): C48.2 R100.2 U17.5(+V)
Net-(C49-2): C49.2 R81.2 R91.2 U13.5(V IN8)
Net-(C50-2): C50.2 R101.2 U16.2(-V)
Net-(C51-2): C51.2 R93.2 R95.2 U13.25(V IN15)
Net-(C52-2): C52.2 R105.2 U17.2(-V)
Net-(C53-2): C53.2 C55.1
Net-(C61-1): C61.1 L2.2 R114.1 U19.3(VIN)
Net-(C62-1): C62.1 R115.2
Net-(C62-2): C62.2 L3.1 U19.2(SW)
Net-(C63-1): C63.1 L3.2 R112.2 R113.1
Net-(C65-1): C65.1 R113.2 R116.2
Net-(C65-2): C65.2 R116.1 R118.1 U19.4(VFB)
Net-(D1-3): D1.3(K) D2.3(K) D3.3(K) D4.3(K) R5.1 U1.19(VCCB)
Net-(D7-1): D7.1(K) D8.1(K)
Net-(D7-2): D7.2(A) R106.2
Net-(D8-2): D8.2(A) R109.2
Net-(ICT1-1): ICT1.1 R95.1
Net-(R1-1): R1.1 R8.1
Net-(R6-1): R6.1 R10.1
Net-(R7-1): R7.1 U1.7(A6) U1.8(A7) U1.9(A8)
Net-(R11-1): R11.1 U1.10(OE)
Net-(R12-1): R12.1 U2.5(A)
Net-(R13-1): R13.1 U2.12(C) U3.2(I)
Net-(R14-1): R14.1 U2.7(A)
Net-(R15-1): R15.1 U2.10(C) U4.2(I)
Net-(R16-1): R16.1 U2.1(A)
Net-(R17-1): R17.1 U2.16(C) U5.2(I)
Net-(R18-1): R18.1 U2.3(A)
Net-(R19-1): R19.1 U2.14(C) U6.2(I)
Net-(R20-1): R20.1 U7.1(A)
Net-(R22-1): R22.1 U7.3(A)
Net-(R24-1): R24.1 U7.5(A)
Net-(R26-1): R26.1 U7.7(A)
Net-(R28-1): R28.1 U8.1(A)
Net-(R30-1): R30.1 U8.3(A)
Net-(R32-1): R32.1 U8.5(A)
Net-(R34-1): R34.1 U8.7(A)
Net-(R36-1): R36.1 U9.1(A)
Net-(R38-1): R38.1 U9.3(A)
Net-(R40-1): R40.1 U9.5(A)
Net-(R42-1): R42.1 U9.7(A)
Net-(R44-1): R44.1 U10.1(A)
Net-(R46-1): R46.1 U10.3(A)
Net-(R48-1): R48.1 U10.5(A)
Net-(R50-1): R50.1 U10.7(A)
Net-(R52-1): R52.1 U11.1(A)
Net-(R54-1): R54.1 U11.3(A)
Net-(R56-1): R56.1 U11.5(A)
Net-(R58-1): R58.1 U11.7(A)
Net-(R61-1): R61.1 R62.1 R63.2 U12.3(-In)
Net-(R62-2): R62.2 R64.1 U12.4(OutPut)
Net-(R76-1): R76.1 R77.1 R80.2
Net-(R77-2): R77.2 R79.1 U14.4(OutPut)
Net-(R78-2): R78.2 U14.3(-In)
Net-(R94-1): R94.1 R96.1 R98.2
Net-(R96-2): R96.2 R99.1 U16.4(OutPut)
Net-(R97-2): R97.2 U16.3(-In)
Net-(R102-2): R102.2 R103.1 U17.3(-In)
Net-(R107-1): R107.1 U13.15(DOUT)
Net-(R110-1): R110.1 U13.18(NC1)
Net-(R111-1): R111.1 U13.4(NC2)
Net-(R112-1): R112.1 TP1.P$1
Net-(R114-2): R114.2 R117.2 U19.5(EN)
Net-(R115-1): R115.1 U19.6(VBST)

Not connected (* = marked no-connect by the designer): J3 5*; U1 12(B8)* 13(B7)* 14(B6)*; U3 1(NC); U4 1(NC); U5 1(NC); U6 1(NC); U13 26(V IN14)* 27(V IN13)*

## Notes on the sheets
sheet 1
- 2.5V
- 1V-4V
- 2.5V
- 1V-4V
- -2.5V
